# EAGLE design Plan1 (EAGLE 9.3.0)
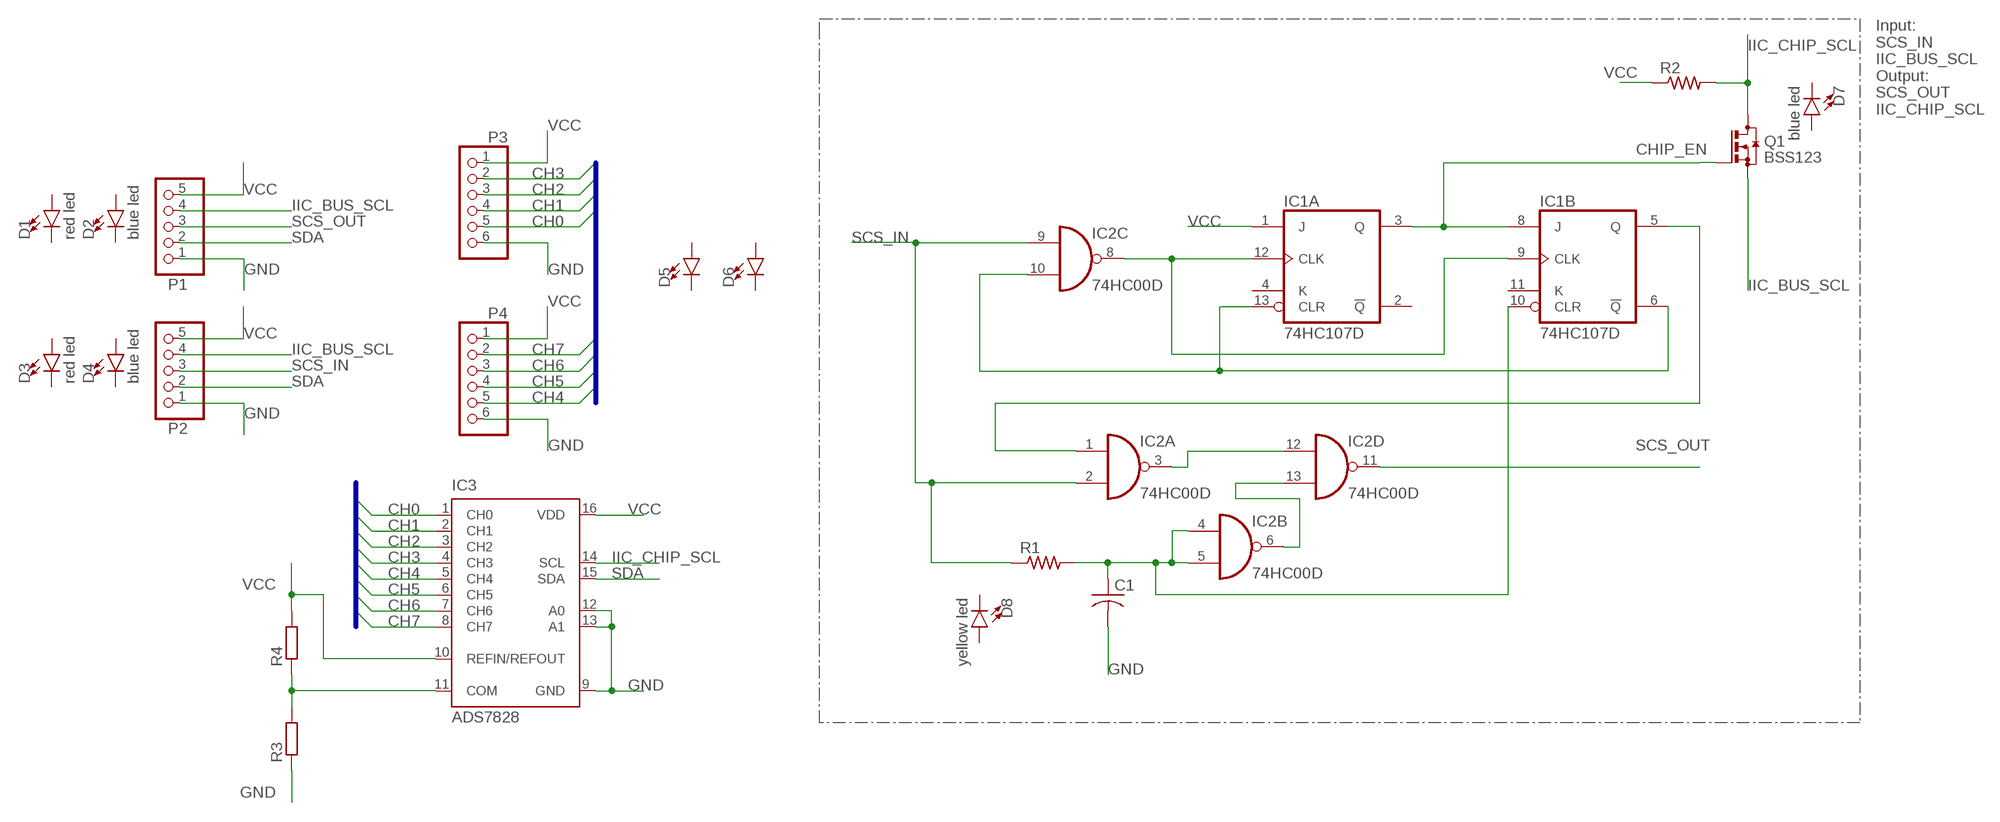
[diagram p0: schematic, sheet 1]

## Parts
C1  C-USC1206  [C1206]
D1  red led  LED0603  [LED-0603]
D2  blue led  LED0603  [LED-0603]
D3  red led  LED0603  [LED-0603]
D4  blue led  LED0603  [LED-0603]
D5  LED0603  [LED-0603]
D6  LED0603  [LED-0603]
D7  blue led  LED0603  [LED-0603]
D8  yellow led  LED0603  [LED-0603]
IC1  74HC107D  [SO14]
IC2  74HC00D  [SO14]
IC3  ADS7828  [TSSOP16-PW]
P1  105313-05  [105313-**05]
P2  105313-05  [105313-**05]
P3  105313-06  [105313-**06]
P4  105313-06  [105313-**06]
Q1  BSS123  [SOT23]
R1  R-US_R1206  [R1206]
R2  R-US_R1206  [R1206]
R3  R-EU_R2012  [R2012]
R4  R-EU_R2012  [R2012]

## Nets
CH0: IC3.1(CH0) P3.5
CH1: IC3.2(CH1) P3.4
CH2: IC3.3(CH2) P3.3
CH3: IC3.4(CH3) P3.2
CH4: IC3.5(CH4) P4.5
CH5: IC3.6(CH5) P4.4
CH6: IC3.7(CH6) P4.3
CH7: IC3.8(CH7) P4.2
CHIP_EN: IC1.3(A:Q) IC1.8(B:J) Q1.1(G)
GND: C1.2 IC3.9(GND) IC3.12(A0) IC3.13(A1) P1.1 P2.1 P3.6 P4.6 R3.1
IIC_BUS_SCL: P1.4 P2.4 Q1.2(S)
IIC_CHIP_SCL: IC3.14(SCL) Q1.3(D) R2.2
N$1: IC1.9(B:CLK) IC1.12(A:CLK) IC2.8(C:O)
N$2: C1.1 IC1.10(B:CLR) IC2.4(B:I0) IC2.5(B:I1) R1.2
N$3: IC2.6(B:O) IC2.13(D:I1)
N$4: IC1.6(B:!Q) IC1.13(A:CLR) IC2.10(C:I1)
N$5: IC1.5(B:Q) IC2.1(A:I0)
N$6: IC2.3(A:O) IC2.12(D:I0)
N$7: IC3.11(COM) R3.2 R4.1
SCS_IN: IC2.2(A:I1) IC2.9(C:I0) P2.3 R1.1
SCS_OUT: IC2.11(D:O) P1.3
SDA: IC3.15(SDA) P1.2 P2.2
VCC: IC1.1(A:J) IC3.10(REFIN/REFOUT) IC3.16(VDD) P1.5 P2.5 P3.1 P4.1 R2.1 R4.2
Unconnected: D1.A D1.C D2.A D2.C D3.A D3.C D4.A D4.C D5.A D5.C D6.A D6.C D7.A D7.C D8.A D8.C IC1.2(A:!Q) IC1.4(A:K) IC1.11(B:K)

## Buses
ANALOG:CH[0..7]

## Notes on the sheet
- Input: 
  SCS_IN
  IIC_BUS_SCL
  Output: 
  SCS_OUT
  IIC_CHIP_SCL

## Power pins joined to a net without a drawn wire
GND: IC1.7(P:GND) IC2.7(P:GND)
VCC: IC1.14(P:VCC) IC2.14(P:VCC)

## Library data of the parts
C1 = rcl:C-US: CAPACITOR, American symbol; SPICEPREFIX: C
D1-D8 = SparkFun-LED:LED: LED (Generic) Standard schematic elements and footprints for 5mm, 3mm, 1206, and 0603 sized LEDs. Generic LEDs with no color specified.
IC1 = 74xx-eu:74*107: Dual J-K FLIP FLOP, clear
IC2 = 74xx-eu:74*00: Quad 2-input NAND gate
IC3 = burr-brown:ADS7828: 12-Bit, 8-Channel Sampling ANALOG-TO-DIGITAL CONVERTER with I2C? Interface Source: www.ti.com .. ADS7828.pdf; MF: TEXAS INSTRUMENTS; MPN: ADS7828E/250; OC_FARNELL: 1470338; OC_NEWARK: 74C7158
P1 P2 = ORBiT-con-molex-nanofit:105313-**05: Molex Nano-Fit Right-Angle Through-Hole Header, 1x5 pins Nano-Fit Power Connectors deliver both fully protected header terminals and a small package, while also offering keying options to ensure proper mating and terminal position assurance (TPA) to reduce terminal back-out. Power-application customers are faced with the decision of choosing between headers with exposed terminals, leaving connectors susceptible to damage, and large, fully-isolated headers that take up too much space. Compact Nano-Fit connectors provide design engineers fully protected header terminals in a small package. Another challenge that design engineers face is meeting the requirement to use multiple headers of the same circuit size on one PCB. This complicates the assembly due to possible mis-mating of a receptacle to the wrong header. Nano-Fit connectors offer different mechanical keying options, enabling customers to reduce the risk of cross mating while improving assembly speed with color-coding logic. Features: The smallest, fully-isolated headers in the market Deliver up to 69% PCB space savings Optional TPA (Terminal Position Assurance) retainer Ensures terminals are fully seated in the housing to reduce terminal back-out Retains terminals if main retention feature fails Positive-lock housing with anti-snag design Ensures mated connector assemblies will not accidentally disengage Provides an audible click while mating. Protects latch from damage due to wire snags Terminal interface with four points of contact Offers redundant, secondary current paths for long-term performance and reliability SMT version enables use of multi-layer boards by eliminating the need for through holes Opens up real estate on space-constricted PCBs Potentially reduces costs by enabling use of smaller PCBs with fewer drilled holes Terminals and headers available in gold and tin plating Delivers different cost options while meeting performance need Multiple mechanical keying and color-coded options Allow same-circuit, multiple-connector use with virtually no chance of cross mating Color coding provides visual indication of the proper mating connector — enabling faster assembly Ultra-low mate force terminal Reduces operator fatigue and improves assembly compliance for high-circuit applications Fully isolated terminals Protect against potential damage of the header and receptacle terminals during handling and mating Retention tang and contact rib Maintains stable contact SMT headers provide short electrical paths Deliver superior signal integrity performance Technical data: Nano-Fit Power Connectors <https://www.molex.com/molex/products/family?key=nanofit_power_connectors>; MF: Molex
P3 P4 = ORBiT-con-molex-nanofit:105313-**06: Molex Nano-Fit Right-Angle Through-Hole Header, 1x6 pins Nano-Fit Power Connectors deliver both fully protected header terminals and a small package, while also offering keying options to ensure proper mating and terminal position assurance (TPA) to reduce terminal back-out. Power-application customers are faced with the decision of choosing between headers with exposed terminals, leaving connectors susceptible to damage, and large, fully-isolated headers that take up too much space. Compact Nano-Fit connectors provide design engineers fully protected header terminals in a small package. Another challenge that design engineers face is meeting the requirement to use multiple headers of the same circuit size on one PCB. This complicates the assembly due to possible mis-mating of a receptacle to the wrong header. Nano-Fit connectors offer different mechanical keying options, enabling customers to reduce the risk of cross mating while improving assembly speed with color-coding logic. Features: The smallest, fully-isolated headers in the market Deliver up to 69% PCB space savings Optional TPA (Terminal Position Assurance) retainer Ensures terminals are fully seated in the housing to reduce terminal back-out Retains terminals if main retention feature fails Positive-lock housing with anti-snag design Ensures mated connector assemblies will not accidentally disengage Provides an audible click while mating. Protects latch from damage due to wire snags Terminal interface with four points of contact Offers redundant, secondary current paths for long-term performance and reliability SMT version enables use of multi-layer boards by eliminating the need for through holes Opens up real estate on space-constricted PCBs Potentially reduces costs by enabling use of smaller PCBs with fewer drilled holes Terminals and headers available in gold and tin plating Delivers different cost options while meeting performance need Multiple mechanical keying and color-coded options Allow same-circuit, multiple-connector use with virtually no chance of cross mating Color coding provides visual indication of the proper mating connector — enabling faster assembly Ultra-low mate force terminal Reduces operator fatigue and improves assembly compliance for high-circuit applications Fully isolated terminals Protect against potential damage of the header and receptacle terminals during handling and mating Retention tang and contact rib Maintains stable contact SMT headers provide short electrical paths Deliver superior signal integrity performance Technical data: Nano-Fit Power Connectors <https://www.molex.com/molex/products/family?key=nanofit_power_connectors>; MF: Molex
Q1 = transistor-small-signal:BSS123: N-CHANNEL MOS FET
R1 R2 = rcl:R-US_: RESISTOR, American symbol; SPICEPREFIX: R
R3 R4 = rcl:R-EU_: RESISTOR, European symbol; SPICEPREFIX: R

## Board
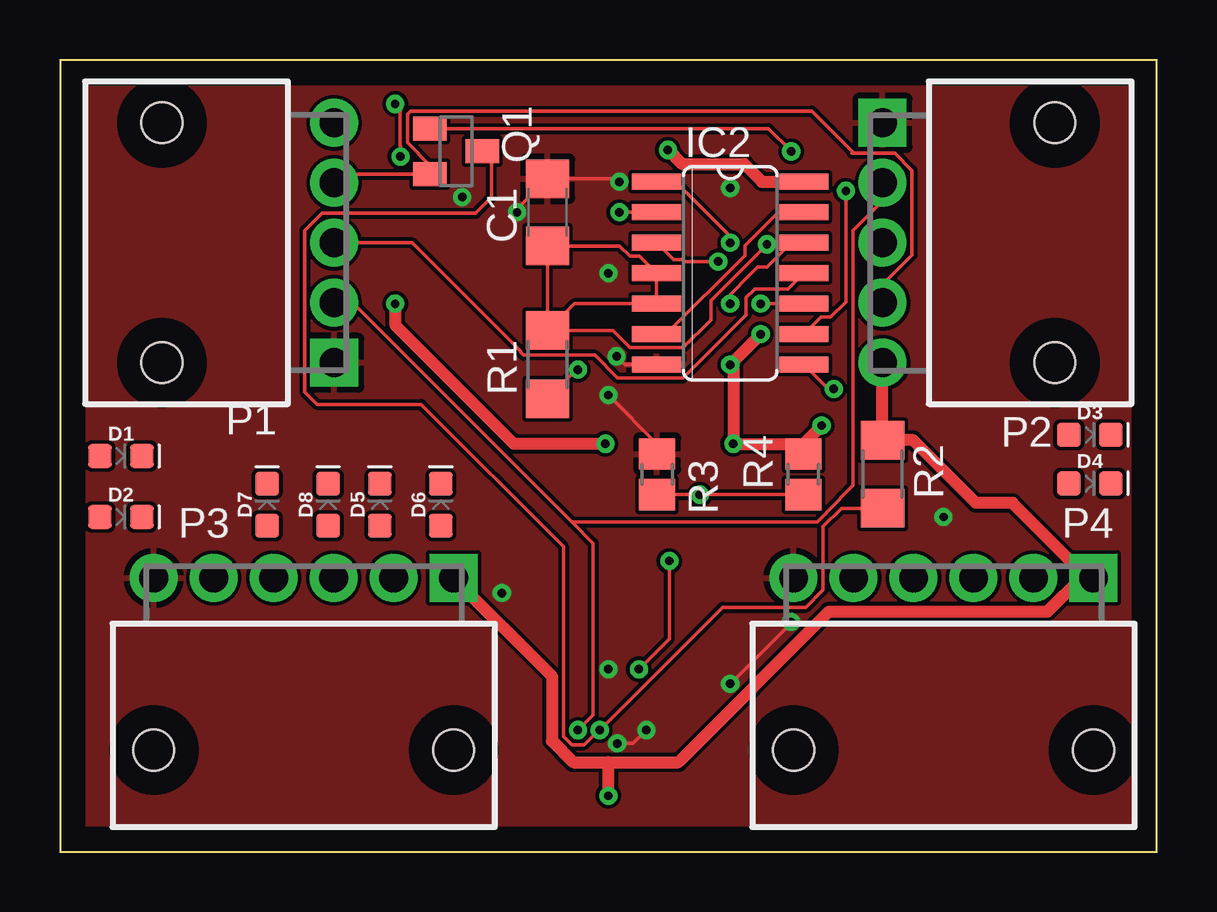
[diagram p1: board, top side]
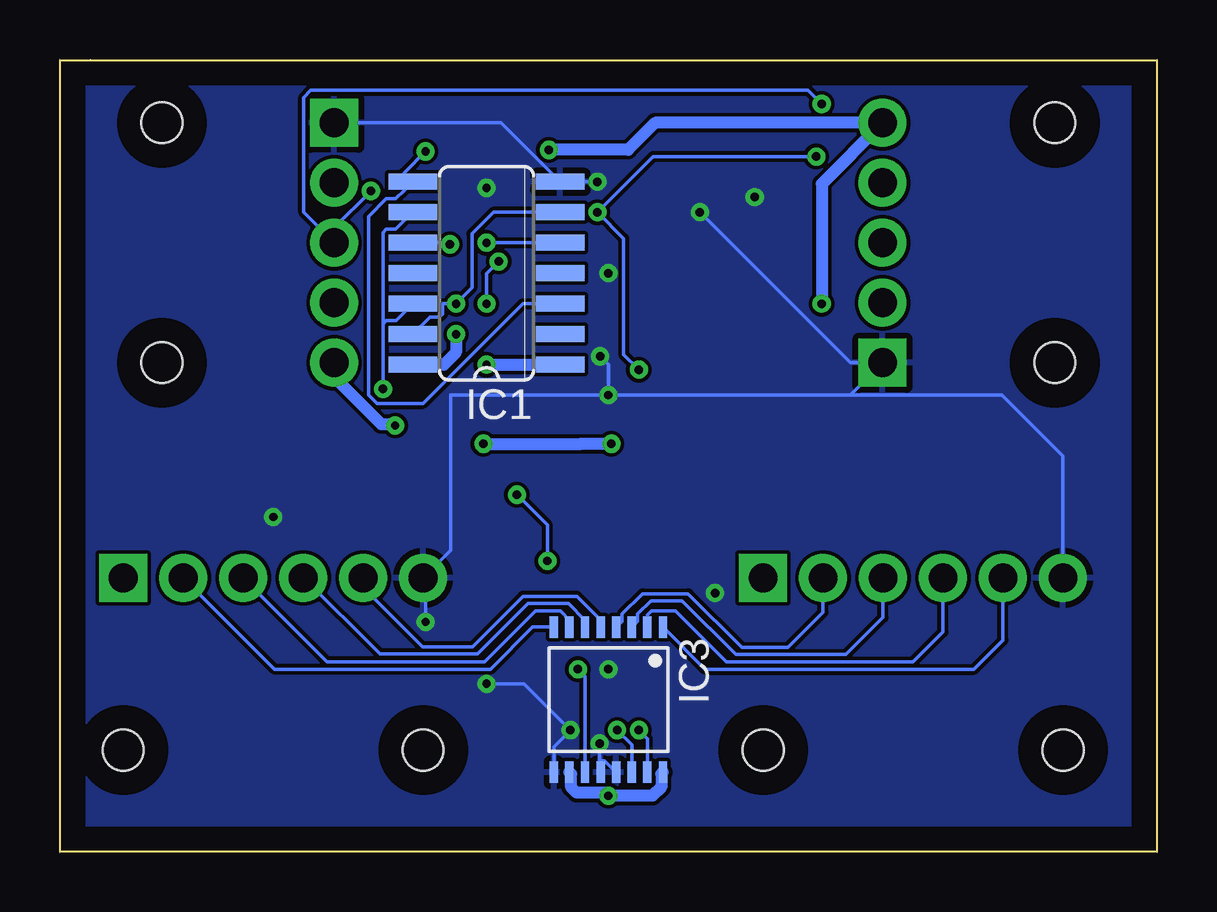
[diagram p2: board, bottom side, seen from below]

Size 45.72 x 33.02 mm. Coordinates in mm from the lower left corner, seen from the top.
Outline: 0,0 45.72,0 45.72,33.02 44.45,33.02 0,33.02 0,0
Copper layers (1*16): Top 0.035mm / dielectric 1.5mm / Bottom 0.035mm
Design rules "default": minimum track width 6mil, minimum drill 0.35mm, track to track 6mil, track to pad 6mil, pad to pad 6mil, via to via 6mil, smd to smd 6mil, copper to edge 40mil, drill to drill 6mil, minimum pad ring 10mil, minimum via ring 8mil, stop-mask expansion 4mil, vias tented up to drill 0mil, thermal gap 10mil

### Footprints (pad centres in the part's own frame; a part is rotated, then mirrored left to right if it is on the bottom)
C1206 = smd 1.6 x 1.8: 1 -1.4,0; 2 1.4,0
LED-0603 = smd 1 x 1: A -0.877,0; C 0.877,0
SO14 = smd 0.66 x 2.032: 1 -3.81,-3.073; 2 -2.54,-3.073; 3 -1.27,-3.073; 4 0,-3.073; 5 1.27,-3.073; 6 2.54,-3.073; 7 3.81,-3.073; 8 3.81,3.073; 9 2.54,3.073; 10 1.27,3.073; 11 0,3.073; 12 -1.27,3.073; 13 -2.54,3.073; 14 -3.81,3.073
TSSOP16-PW = smd 0.35 x 0.9: 1 -2.275,-3.025; 2 -1.625,-3.025; 3 -0.975,-3.025; 4 -0.325,-3.025; 5 0.325,-3.025; 6 0.975,-3.025; 7 1.625,-3.025; 8 2.275,-3.025; 9 2.275,3.025; 10 1.625,3.025; 11 0.975,3.025; 12 0.325,3.025; 13 -0.325,3.025; 14 -0.975,3.025; 15 -1.625,3.025; 16 -2.275,3.025
105313-**05 = drill 1.2 pad 2 square: 1 5,0 | drill 1.2 pad 2: 2 2.5,0; 3 0,0; 4 -2.5,0; 5 -5,0 | hole 1.7: -5,-7.18; 5,-7.18
105313-**06 = drill 1.2 pad 2 square: 1 6.25,0 | drill 1.2 pad 2: 2 3.75,0; 3 1.25,0; 4 -1.25,0; 5 -3.75,0; 6 -6.25,0 | hole 1.7: -6.25,-7.18; 6.25,-7.18
SOT23 = smd 1 x 1.4: 1 -0.95,-1.1; 2 0.95,-1.1; 3 0,1.1
R1206 = smd 1.6 x 1.803: 1 -1.422,0; 2 1.422,0
R2012 = smd 1.3 x 1.5: 1 -0.85,0; 2 0.85,0

### Placement (x,y rotation side)
C1  20.32,26.67 90 top
D1  2.54,16.51 0 top
D2  2.54,13.97 0 top
D3  42.93,17.4 0 top
D4  42.93,15.37 0 top
D5  13.34,14.48 90 top
D6  15.88,14.48 90 top
D7  8.64,14.48 90 top
D8  11.18,14.48 90 top
IC1  27.94,24.13 90 bottom
IC2  27.94,24.13 270 top
IC3  22.86,6.35 180 bottom
P1  11.43,25.4 270 top
P2  34.29,25.4 90 top
P3  10.16,11.43 0 top
P4  36.83,11.43 0 top
Q1  16.51,29.21 270 top
R1  20.32,20.32 90 top
R2  34.29,15.75 270 top
R3  24.89,15.75 270 top
R4  30.99,15.75 90 top

### Tracks (layer width: path | path; a pad name or v marks a point on that pad's centre or on a via)
CH0
  Bottom 0.152: IC3.1 18.83,7.62 7.62,7.62 6.41,8.83 P3.5
CH1
  Bottom 0.152: IC3.2 21.23,9.88 21.06,10.05 20.06,10.05 17.93,7.92 10.16,7.92 8.91,9.18 P3.4
CH2
  Bottom 0.152: IC3.3 21.64,9.62 21.64,9.92 21.09,10.46 19.79,10.46 17.55,8.23 12.95,8.23 11.41,9.77 P3.3
CH3
  Bottom 0.152: IC3.4 22.29,9.62 22.29,9.92 21.44,10.77 19.53,10.77 17.3,8.53 15.37,8.53 13.91,9.99 P3.2
CH4
  Bottom 0.152: IC3.5 23.18,9.67 24.18,10.66 26.42,10.66 28.52,8.56 30.61,8.56 33.08,11.03 P4.5
CH5
  Bottom 0.152: IC3.6 23.83,9.38 23.83,9.67 24.52,10.36 26.22,10.36 28.32,8.26 32.38,8.26 35.56,11.43 P4.4
CH6
  Bottom 0.152: IC3.7 24.48,9.67 24.86,10.05 25.89,10.05 28.02,7.92 34.58,7.92 P4.3
CH7
  Bottom 0.152: IC3.8 26.02,9.38 27.78,7.62 36.77,7.62 P4.2
CHIP_EN  (via drill 0.35)
  Top 0.152: Q1.1 29.53,30.16 v30.48,29.21
  Bottom 0.152: IC1.8 31.38,27.57 | 31.38,27.57 31.73,27.23 32.12,27.23 32.87,26.49 32.87,19.05 32.51,18.7 30.59,18.7 26.42,22.86 IC1.3 | v30.48,29.21 31.38,28.31 31.38,27.57
GND  (via drill 0.35)
  Top 0.152: R3.1 24.89,17.02 v22.86,19.05 | v23.2,20.66 23.55,20.32 IC2.7 | v24.44,5.08 23.89,4.52 v23.23,4.52 | v27.94,7.01 30.48,9.55 v30.48,9.6 | v19.05,26.67 19.05,26.8 C1.2 23.19,28.07 v23.32,27.94
  Bottom 0.152: v22.86,19.05 22.86,20.32 v23.2,20.66 | IC3.9 25.14,4.39 v24.44,5.08 26.38,7.01 v27.94,7.01 | v23.23,4.52 23.23,3.81 | 23.23,3.81 23.23,3.37 IC3.12 | IC3.13 23.02,3.81 23.23,3.81 | v30.48,9.6 30.48,11.33 P4.6 29.44,12.57 29.44,19.05 v22.86,19.05 | v22.86,19.05 12.78,19.05 | 12.78,19.05 P1.1 12.78,20.4 v19.05,26.67 | v23.32,27.94 IC1.7 27.33,30.4 P2.1 | P3.6 3.91,16.51 6.45,19.05 12.78,19.05
  other vias: 36.83,13.97 22.86,7.62 22.86,24.13 18.41,10.79 16.76,27.3 27.94,27.69
  pour Top: 0,33.02 0,0 45.72,0 45.72,33.02
  pour Bottom: 0,33.02 0,0 45.72,0 45.72,33.02
IIC_BUS_SCL
  Top 0.152: P1.4 11.79,28.26 Q1.2 15.41,28.64 14.48,29.57 14.48,30.75 14.62,30.89 31.34,30.89 33.06,29.17 33.02,29.13 34.8,29.13 35.52,28.41 35.52,24.89 34.29,23.66 P2.4
IIC_CHIP_SCL  (via drill 0.35)
  Top 0.152: v22.5,5.08 22.68,5.26 | 22.68,5.26 27.62,10.2 31.09,10.2 31.81,10.92 31.81,13.56 32.57,14.33 R2.2 | Q1.3 17.99,28.83 17.99,27.29 17.33,26.63 10.92,26.63 10.2,25.91 10.2,19.18 10.72,18.66 15.06,18.66 20.98,12.74 20.98,4.83 21.34,4.47 21.84,4.47 22.63,5.26 22.68,5.26
  Bottom 0.152: IC3.14 21.89,4.47 v22.5,5.08
N$1  (via drill 0.35)
  Top 0.152: v32.26,19.3 32.03,19.3 IC2.8
  Bottom 0.152: IC1.9 31.73,25.96 32.12,25.96 32.26,25.82 32.26,22.86 32.26,21.59 | 32.26,21.59 v32.26,19.3 | IC1.12 31.01,22.84 31.7,22.15 32.12,22.15 32.26,22.02 32.26,21.59
N$2  (via drill 0.35)
  Top 0.152: R1.2 21.44,22.86 IC2.5 IC2.4 24.16,24.84 23.76,24.84 23.33,25.27 C1.1 R1.2 | v29.47,25.33 27.13,22.99 27.13,22.18 25.98,21.03 23.76,21.03 23.05,21.74 R1.2
  Bottom 0.152: v29.47,25.33 29.54,25.4 IC1.10
N$3
  Top 0.152: IC2.13 29.95,26.67 28.55,25.27 28.55,24.87 25.27,21.59 IC2.6
N$4  (via drill 0.35)
  Top 0.152: v29.21,22.86 IC2.10
  Bottom 0.152: IC1.6 27.66,26.67 28.55,25.78 28.55,23.52 v29.21,22.86 29.74,22.86 29.77,22.84 29.77,22.43 29.9,22.3 30.3,22.3 IC1.13
N$5  (via drill 0.35)
  Top 0.152: IC2.1 25.65,27.94 27.94,25.65 v27.94,25.4
  Bottom 0.152: v27.94,25.4 IC1.5
N$6  (via drill 0.35)
  Top 0.152: IC2.3 25.58,24.69 25.98,24.69 26.05,24.62 v27.44,24.62 | v27.94,22.86 27.94,23.24 28.73,24.03 29.08,24.38 29.46,24.38 30.48,25.4 IC2.12
  Bottom 0.152: v27.44,24.62 27.94,24.11 v27.94,22.86
N$7  (via drill 0.35)
  Top 0.152: R3.2 v26.67,14.9 R4.1 | v24.13,7.62 25.4,8.89 v25.4,12.13
  Bottom 0.152: IC3.11 23.84,7.33 v24.13,7.62 | v25.4,12.13 25.4,13.63 v26.67,14.9
SCS_IN  (via drill 0.35)
  Top 0.152: R1.1 21.53,20.11 v21.59,20.11 | v23.32,26.67 IC2.2 | v13.97,31.18 14.19,30.96 14.19,30.9 14.18,30.88 14.18,29.44 14.19,29.42 v14.19,28.99 | IC2.9 31.73,22.3 32.12,22.3 32.76,22.93 v32.76,27.56
  Bottom 0.152: v21.59,20.11 22.23,20.74 22.23,25.57 v23.32,26.67 21,28.99 v14.19,28.99 | v13.97,31.18 14.54,31.75 35.26,31.75 35.56,31.45 35.56,26.67 P2.3 34.29,26.03 v32.76,27.56
SCS_OUT
  Top 0.152: IC2.11 30.35,23.47 28.96,23.47 28.6,23.11 28.6,22.39 25.98,19.76 24.13,19.76 23.25,19.76 22.3,20.71 19.32,20.71 19.19,20.85 19.19,20.89 14.68,25.4 P1.3
SDA  (via drill 0.35)
  Top 0.152: v21.59,5.08 22.23,5.71 22.23,12.87 21.34,13.76 | 21.34,13.76 12.19,22.9 P1.2 | 21.34,13.76 31.57,13.76 31.97,14.15 31.97,14.19 33.06,15.28 33.06,25.91 34.29,27.14 P2.2
  Bottom 0.152: IC3.15 21.23,4.72 v21.59,5.08
VCC  (via drill 0.35)
  Top 0.508: P3.1 20.5,7.34 20.5,4.63 21.39,3.74 22.86,3.74 | 22.86,3.74 25.78,3.74 32.06,10.02 41.16,10.02 42.57,11.43 P4.1 42.83,11.43 39.7,14.55 38.18,14.55 35.56,17.17 R2.1 P2.5 | v31.75,17.78 30.99,17.02 | 30.99,17.02 R4.2 | v25.34,29.27 25.93,28.68 28.52,28.68 29.26,27.94 IC2.14 | v22.73,17.02 18.92,17.02 13.97,21.97 v13.97,22.86 | v29.21,21.59 v27.94,20.32 28.07,20.19 v28.07,17.02 30.99,17.02 | v22.86,2.34 22.86,3.74
  Bottom 0.508: v31.75,17.78 31.75,17.83 32.33,17.83 34.29,19.8 P2.5 | v25.34,29.27 22.04,29.27 20.91,30.4 P1.5 13.97,27.86 v13.97,22.86 | v28.07,17.02 24,17.02 v22.73,17.02 | v27.94,20.32 IC1.1 | v29.21,21.59 29.21,20.83 29.44,20.6 29.72,20.32 IC1.14 | IC3.16 20.65,3.26 20.65,2.71 21.02,2.34 v22.86,2.34 22.98,2.47 24.18,2.47 24.42,2.71 24.42,3.26 IC3.10